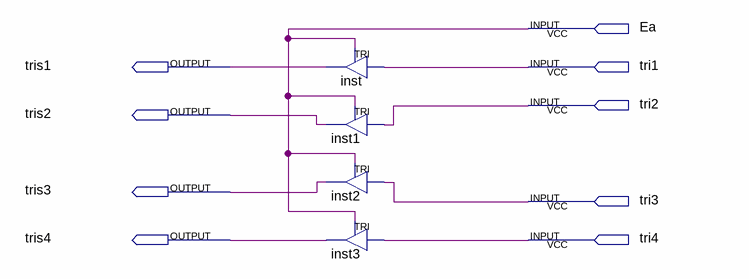
[diagram p0: schematic sheet]
// Quartus schematic C12.bdf as structural Verilog: 4 symbols, 9 pins
module C12 (
  input  Ea,
  input  \tri1 ,
  input  tri2,
  input  tri3,
  input  tri4,
  output tris1,
  output tris2,
  output tris3,
  output tris4
);

  TRI inst (.IN(\tri1 ), .OE(Ea), .OUT(tris1));
  TRI inst1 (.IN(tri2), .OE(Ea), .OUT(tris2));
  TRI inst2 (.IN(tri3), .OE(Ea), .OUT(tris3));
  TRI inst3 (.IN(tri4), .OE(Ea), .OUT(tris4));
endmodule
